# EAGLE design ETS2-Interface (EAGLE 7.7.0)
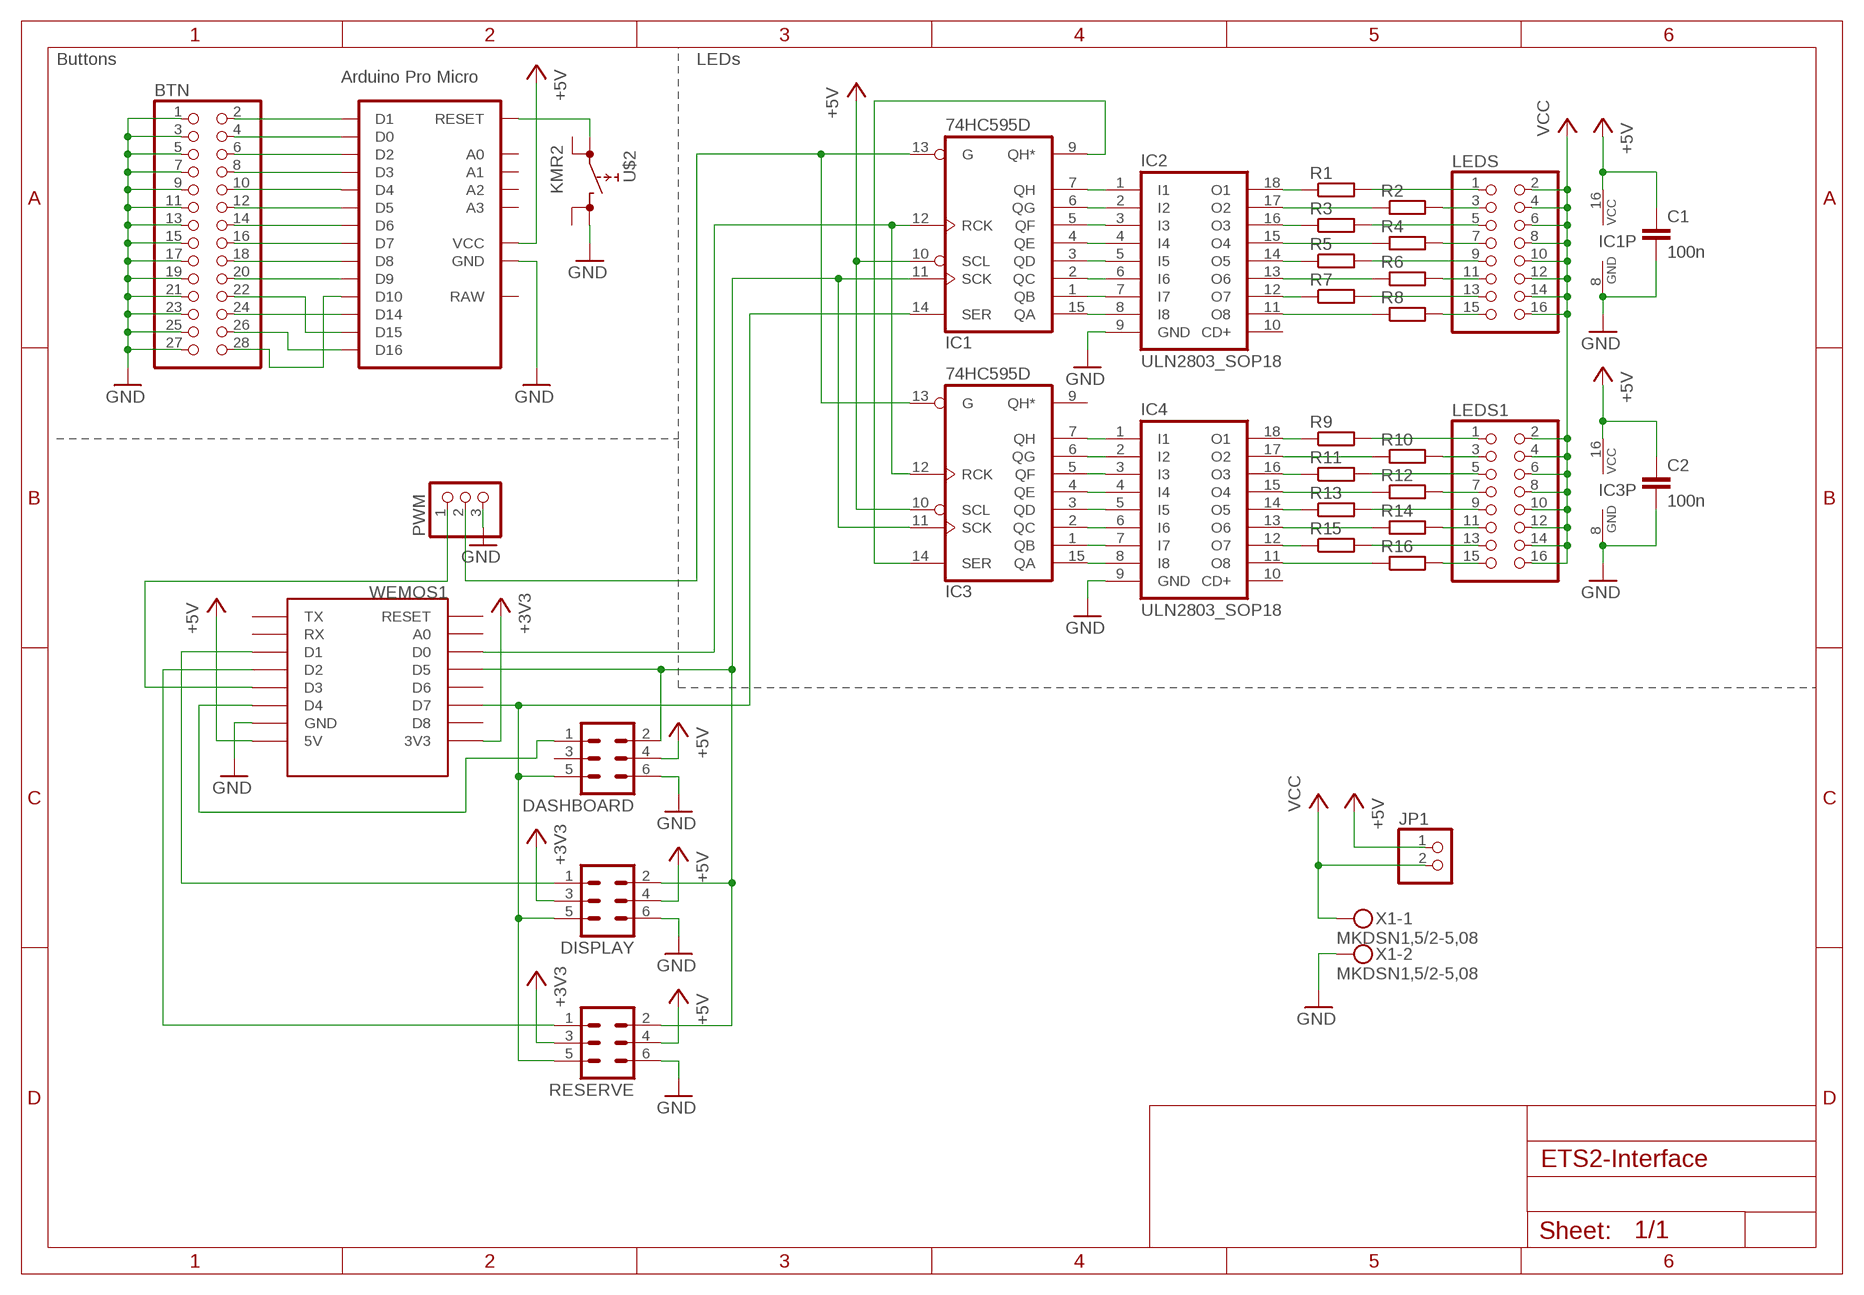
[diagram p0: schematic, sheet 1]

## Parts
BTN  PINHD-2X14_2.54  [2X14]
C1  100n  C-EUC0805  [C0805]
C2  100n  C-EUC0805  [C0805]
DASHBOARD  ML6  [ML6]
DISPLAY  ML6  [ML6]
IC1  74HC595D  [SO16]
IC2  ULN2803_SOP18  [SOP18]
IC3  74HC595D  [SO16]
IC4  ULN2803_SOP18  [SOP18]
JP1  PINHD-1X02_2.54-S  [1X02-S]
LEDS  PINHD-2X08_2.54  [2X08]
LEDS1  PINHD-2X08_2.54  [2X08]
PWM  PINHD-1X03_2.54-S  [1X03-S]
R1  R-EU_R0805  [R0805]
R2  R-EU_R0805  [R0805]
R3  R-EU_R0805  [R0805]
R4  R-EU_R0805  [R0805]
R5  R-EU_R0805  [R0805]
R6  R-EU_R0805  [R0805]
R7  R-EU_R0805  [R0805]
R8  R-EU_R0805  [R0805]
R9  R-EU_R0805  [R0805]
R10  R-EU_R0805  [R0805]
R11  R-EU_R0805  [R0805]
R12  R-EU_R0805  [R0805]
R13  R-EU_R0805  [R0805]
R14  R-EU_R0805  [R0805]
R15  R-EU_R0805  [R0805]
R16  R-EU_R0805  [R0805]
RESERVE  ML6  [ML6]
U$1  PRO-MICRO  [PRO-MICRO]
U$2  KMR2  [KMR2]
WEMOS1  WEMOS-D1-MINI  [WEMOS-D1-MINI]
X1  MKDSN1,5/2-5,08  [MKDSN1,5/2-5,08]

## Nets
+3V3: DISPLAY.3 RESERVE.3 WEMOS1.3V3
+5V: C1.1 C2.1 DASHBOARD.4 DISPLAY.4 IC1.10(SCL) IC1.16(VCC) IC3.10(SCL) IC3.16(VCC) JP1.1 RESERVE.4 U$1.VCC WEMOS1.5V
CLOCK: DASHBOARD.2 DISPLAY.2 IC1.11(SCK) IC3.11(SCK) RESERVE.2 WEMOS1.D5
GND: BTN.1 BTN.3 BTN.5 BTN.7 BTN.9 BTN.11 BTN.13 BTN.15 BTN.17 BTN.19 BTN.21 BTN.23 BTN.25 BTN.27 C1.2 C2.2 DASHBOARD.6 DISPLAY.6 IC1.8(GND) IC2.9(GND) IC3.8(GND) IC4.9(GND) PWM.3 RESERVE.6 U$1.GND U$1.GND1(GND) U$1.GND2(GND) U$2.3 WEMOS1.GND X1.2
LATCH: DASHBOARD.1 WEMOS1.D4
MOSI: DASHBOARD.5 DISPLAY.5 IC1.14(SER) RESERVE.5 WEMOS1.D7
N$1: BTN.2 U$1.D1
N$2: BTN.4 U$1.D0
N$3: BTN.6 U$1.D2
N$4: BTN.8 U$1.D3
N$5: BTN.10 U$1.D4
N$6: BTN.12 U$1.D5
N$7: BTN.14 U$1.D6
N$8: BTN.16 U$1.D7
N$9: BTN.18 U$1.D8
N$10: BTN.20 U$1.D9
N$11: IC1.7(QH) IC2.1(I1)
N$12: IC1.6(QG) IC2.2(I2)
N$13: IC1.5(QF) IC2.3(I3)
N$14: IC1.4(QE) IC2.4(I4)
N$15: IC1.3(QD) IC2.5(I5)
N$16: IC1.2(QC) IC2.6(I6)
N$17: IC1.1(QB) IC2.7(I7)
N$18: IC1.15(QA) IC2.8(I8)
N$19: IC2.18(O1) R1.1
N$20: IC2.17(O2) R2.1
N$21: IC2.16(O3) R3.1
N$22: IC2.15(O4) R4.1
N$23: IC2.14(O5) R5.1
N$24: IC2.13(O6) R6.1
N$25: IC2.12(O7) R7.1
N$26: IC2.11(O8) R8.1
N$27: LEDS.15 R8.2
N$28: LEDS.13 R7.2
N$29: LEDS.11 R6.2
N$30: LEDS.9 R5.2
N$31: LEDS.7 R4.2
N$32: LEDS.5 R3.2
N$33: LEDS.3 R2.2
N$34: LEDS.1 R1.2
N$35: BTN.28 U$1.D10
N$36: BTN.26 U$1.D16
N$37: BTN.24 U$1.D14
N$38: BTN.22 U$1.D15
N$39: IC3.7(QH) IC4.1(I1)
N$40: IC3.6(QG) IC4.2(I2)
N$41: IC3.5(QF) IC4.3(I3)
N$42: IC3.4(QE) IC4.4(I4)
N$43: IC3.3(QD) IC4.5(I5)
N$44: IC3.2(QC) IC4.6(I6)
N$45: IC3.1(QB) IC4.7(I7)
N$46: IC3.15(QA) IC4.8(I8)
N$47: IC4.18(O1) R9.1
N$48: IC4.17(O2) R10.1
N$49: IC4.16(O3) R11.1
N$50: IC4.15(O4) R12.1
N$51: IC4.14(O5) R13.1
N$52: IC4.13(O6) R14.1
N$53: IC4.12(O7) R15.1
N$54: IC4.11(O8) R16.1
N$55: LEDS1.15 R16.2
N$56: LEDS1.13 R15.2
N$57: LEDS1.11 R14.2
N$58: LEDS1.9 R13.2
N$59: LEDS1.7 R12.2
N$60: LEDS1.5 R11.2
N$61: LEDS1.3 R10.2
N$62: LEDS1.1 R9.2
N$63: RESERVE.1 WEMOS1.D2
N$64: IC1.9(QH*) IC3.14(SER)
N$65: IC1.12(RCK) IC3.12(RCK) WEMOS1.D0
N$66: DISPLAY.1 WEMOS1.D1
N$67: PWM.1 WEMOS1.D3
N$68: IC1.13(G) IC3.13(G) PWM.2
N$69: U$1.RESET U$2.1
VCC: JP1.2 LEDS1.2 LEDS1.4 LEDS1.6 LEDS1.8 LEDS1.10 LEDS1.12 LEDS1.14 LEDS1.16 LEDS.2 LEDS.4 LEDS.6 LEDS.8 LEDS.10 LEDS.12 LEDS.14 LEDS.16 X1.1
Unconnected: DASHBOARD.3 IC2.10(CD+) IC3.9(QH*) IC4.10(CD+) U$1.A0 U$1.A1 U$1.A2 U$1.A3 U$1.RAW U$2.2 U$2.4 WEMOS1.A0 WEMOS1.D6 WEMOS1.D8 WEMOS1.RESET WEMOS1.RX WEMOS1.TX

## Notes on the sheet
- Buttons | LEDs
- Arduino Pro Micro

## Library data of the parts
BTN = pinhead-2:PINHD-2X14: PIN HEADER
C1 C2 = rcl:C-EU: CAPACITOR, European symbol
DASHBOARD DISPLAY RESERVE = con-harting-ml:ML6: HARTING; OC_FARNELL: unknown; OC_NEWARK: unknown
IC1 IC3 = 74xx-eu:74*595: 8-bit SHIFT REGISTER, output latch
IC2 IC4 = EA Displays:ULN2803_SOP18
JP1 = pinhead-2:PINHD-1X02: PIN HEADER
LEDS LEDS1 = pinhead-2:PINHD-2X08: PIN HEADER
PWM = pinhead-2:PINHD-1X03: PIN HEADER
R1-R16 = rcl:R-EU_: RESISTOR, European symbol
U$1 = Arduino-clone:PRO-MICRO
U$2 = Cekalla:KMR2
WEMOS1 = esp8266modules:WEMOS-D1-MINI: WeMos.cc D1 mini ESP8266 module
X1 = con-phoenix-508:MKDSN1,5/2-5,08: MKDSN 1,5/ 2-5,08 Printklemme Nennstrom: 13,5 A Nennspannung: 250 V Rastermaß: 5,08 mm Polzahl: 2 Anschlussart: Schraubanschluss Montage: Löten Anschlussrichtung Leiter/Platine: 0 ° Artikelnummer: 1729128 Source: http://eshop.phoenixcontact.com .. 1729128.pdf

## Board
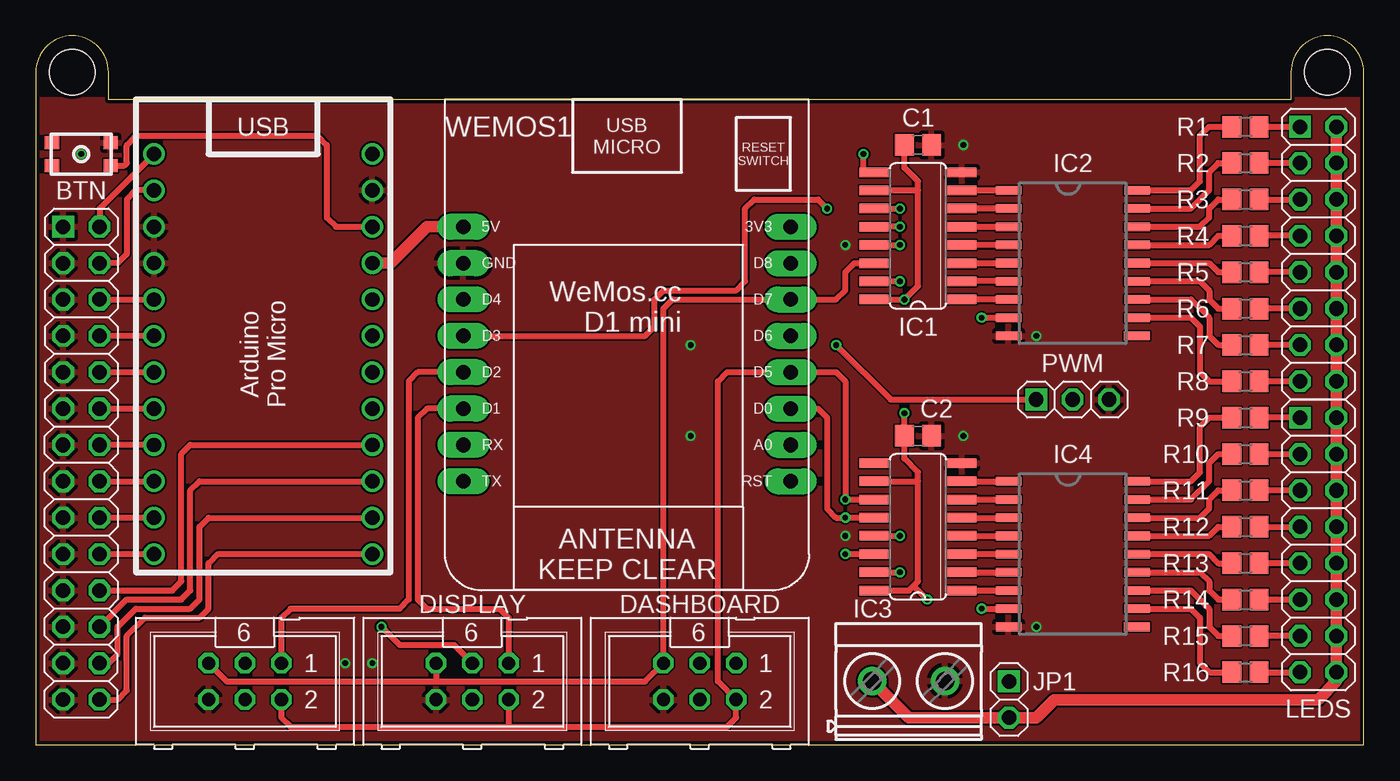
[diagram p1: board, top side]
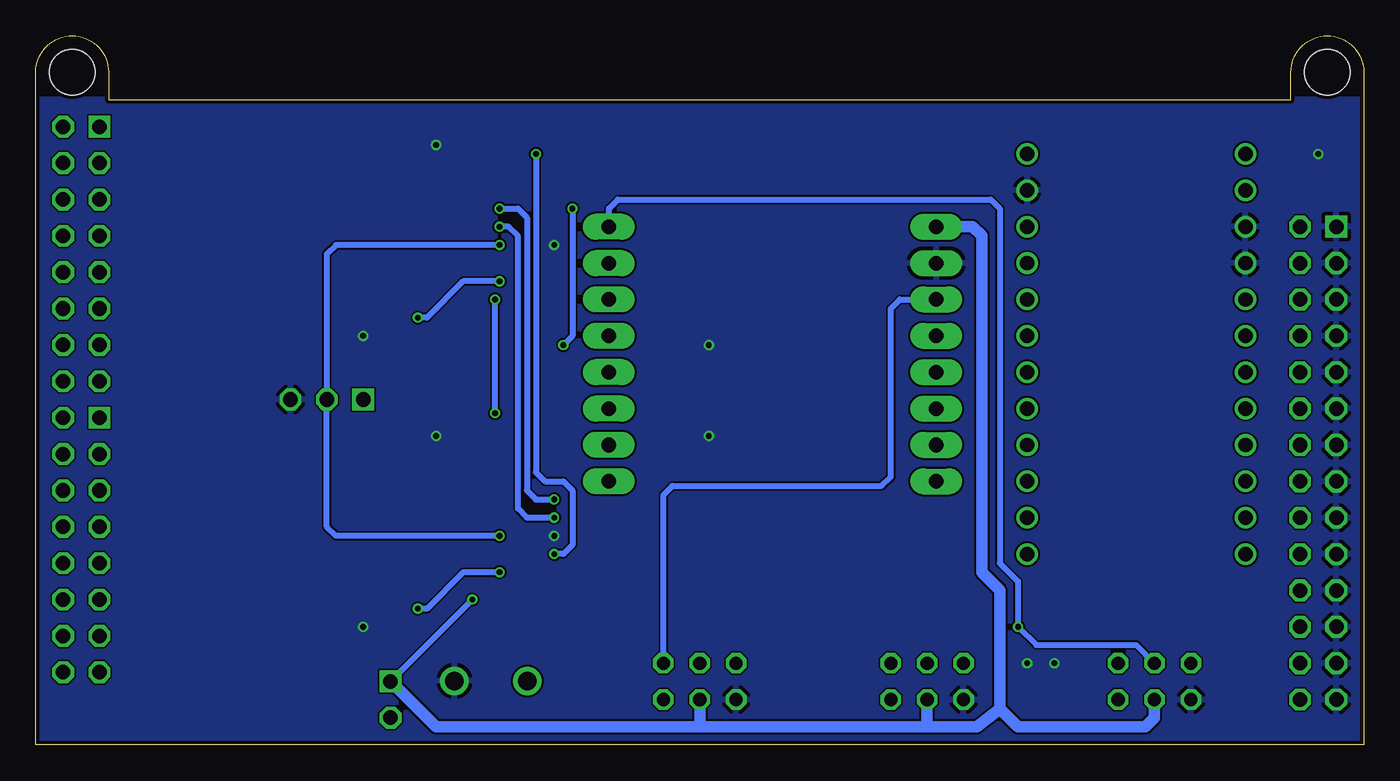
[diagram p2: board, bottom side, seen from below]

Size 92.71 x 49.53 mm. Coordinates in mm from the lower left corner, seen from the top.
Outline: 0,0 92.71,0 92.71,46.99 arc90 90.17,49.53 arc90 87.63,46.99 87.63,45.09 5.08,45.09 5.08,46.99 arc90 2.54,49.53 arc90 0,46.99 0,0
Copper layers (1*16): Top 0.035mm / dielectric 1.5mm / Bottom 0.035mm
Design rules "JLCPCB": minimum track width 5mil, minimum drill 0.3mm, track to track 5mil, track to pad 5mil, pad to pad 5mil, via to via 5mil, smd to smd 0mil, copper to edge 10mil, drill to drill 10mil, minimum pad ring 10mil, minimum via ring 6mil, stop-mask expansion 2mil, vias tented up to drill 100mil, thermal gap 10mil
Holes 3.2 mm at 2.54,46.99 90.17,46.99

### Footprints (pad centres in the part's own frame; a part is rotated, then mirrored left to right if it is on the bottom)
2X14 = drill 1.016 square: 1 -16.51,-1.27 | drill 1.016 octagon: 2 -16.51,1.27; 3 -13.97,-1.27; 4 -13.97,1.27; 5 -11.43,-1.27; 6 -11.43,1.27; 7 -8.89,-1.27; 8 -8.89,1.27; 9 -6.35,-1.27; 10 -6.35,1.27; 11 -3.81,-1.27; 12 -3.81,1.27; 13 -1.27,-1.27; 14 -1.27,1.27; 15 1.27,-1.27; 16 1.27,1.27; 17 3.81,-1.27; 18 3.81,1.27; 19 6.35,-1.27; 20 6.35,1.27; 21 8.89,-1.27; 22 8.89,1.27; 23 11.43,-1.27; 24 11.43,1.27; 25 13.97,-1.27; 26 13.97,1.27; 27 16.51,-1.27; 28 16.51,1.27
C0805 = smd 1.3 x 1.5: 1 -0.95,0; 2 0.95,0
ML6 = drill 0.914 octagon: 1 -2.54,-1.27; 2 -2.54,1.27; 3 0,-1.27; 4 0,1.27; 5 2.54,-1.27; 6 2.54,1.27
SO16 = smd 0.66 x 2.032: 1 -4.445,-3.073; 2 -3.175,-3.073; 3 -1.905,-3.073; 4 -0.635,-3.073; 5 0.635,-3.073; 6 1.905,-3.073; 7 3.175,-3.073; 8 4.445,-3.073; 9 4.445,3.073; 10 3.175,3.073; 11 1.905,3.073; 12 0.635,3.073; 13 -0.635,3.073; 14 -1.905,3.073; 15 -3.175,3.073; 16 -4.445,3.073
SOP18 = smd 0.6 x 1.8: 1 -5.08,-4.475; 2 -3.81,-4.475; 3 -2.54,-4.475; 4 -1.27,-4.475; 5 0,-4.475; 6 1.27,-4.475; 7 2.54,-4.475; 8 3.81,-4.475; 9 5.08,-4.475; 10 5.08,4.475; 11 3.81,4.5; 12 2.54,4.5; 13 1.27,4.5; 14 0,4.5; 15 -1.27,4.5; 16 -2.54,4.5; 17 -3.81,4.5; 18 -5.08,4.5
1X02-S = drill 1.016 square: 1 -1.27,0 | drill 1.016 octagon: 2 1.27,0
2X08 = drill 1.016 square: 1 -8.89,-1.27 | drill 1.016 octagon: 2 -8.89,1.27; 3 -6.35,-1.27; 4 -6.35,1.27; 5 -3.81,-1.27; 6 -3.81,1.27; 7 -1.27,-1.27; 8 -1.27,1.27; 9 1.27,-1.27; 10 1.27,1.27; 11 3.81,-1.27; 12 3.81,1.27; 13 6.35,-1.27; 14 6.35,1.27; 15 8.89,-1.27; 16 8.89,1.27
1X03-S = drill 1.016 square: 1 -2.54,0 | drill 1.016 octagon: 2 0,0; 3 2.54,0
R0805 = smd 1.3 x 1.5: 1 -0.95,0; 2 0.95,0
PRO-MICRO = drill 1: A0 7.62,-3.81; A1 7.62,-1.27; A2 7.62,1.27; A3 7.62,3.81; D0 -7.62,11.43; D1 -7.62,13.97; D2 -7.62,3.81; D3 -7.62,1.27; D4 -7.62,-1.27; D5 -7.62,-3.81; D6 -7.62,-6.35; D7 -7.62,-8.89; D8 -7.62,-11.43; D9 -7.62,-13.97; D10 7.62,-13.97; D14 7.62,-8.89; D15 7.62,-6.35; D16 7.62,-11.43; GND 7.62,11.43; GND1 -7.62,8.89; GND2 -7.62,6.35; RAW 7.62,13.97; RESET 7.62,8.89; VCC 7.62,6.35
KMR2 = smd 1 x 0.9: 1 -2.05,0.8; 2 2.05,0.8; 3 -2.05,-0.8; 4 2.05,-0.8
WEMOS-D1-MINI = drill 1.016 pad 1.829 long: 3V3 -10.16,-10.16; 5V 12.7,-10.16; A0 -10.16,5.08; D0 -10.16,2.54; D1 12.7,2.54; D2 12.7,0; D3 12.7,-2.54; D4 12.7,-5.08; D5 -10.16,0; D6 -10.16,-2.54; D7 -10.16,-5.08; D8 -10.16,-7.62; GND 12.7,-7.62; RESET -10.16,7.62; RX 12.7,5.08; TX 12.7,7.62
MKDSN1,5/2-5,08 = drill 1.3 pad 2: 1 -2.561,0.025; 2 2.519,0.025

### Placement (x,y rotation side)
BTN  3.17,19.68 270 top
C1  61.59,41.91 0 top
C2  61.59,21.59 0 top
DASHBOARD  46.35,4.45 180 top
DISPLAY  30.48,4.45 180 top
IC1  61.59,35.56 90 top
IC2  72.39,33.66 270 top
IC3  61.59,15.24 90 top
IC4  72.39,13.34 270 top
JP1  67.94,3.17 270 top
LEDS  89.53,34.29 270 top
LEDS1  89.53,13.97 270 top
PWM  72.39,24.13 0 top
R1  84.45,43.18 0 top
R2  84.45,40.64 0 top
R3  84.45,38.1 0 top
R4  84.45,35.56 0 top
R5  84.45,33.02 0 top
R6  84.45,30.48 0 top
R7  84.45,27.94 0 top
R8  84.45,25.4 0 top
R9  84.45,22.86 0 top
R10  84.45,20.32 0 top
R11  84.45,17.78 0 top
R12  84.45,15.24 0 top
R13  84.45,12.7 0 top
R14  84.45,10.16 0 top
R15  84.45,7.62 0 top
R16  84.45,5.08 0 top
RESERVE  14.61,4.45 180 top
U$1  15.88,27.3 0 top
U$2  3.17,41.27 180 top
WEMOS1  42.55,26.04 180 top
X1  60.96,4.45 0 top

### Tracks (layer width: path | path; a pad name or v marks a point on that pad's centre or on a via)
+3V3  (via drill 0.4)
  Top 0.406: v24.13,8.26 25.4,6.99 29.21,6.99 DISPLAY.3
  Bottom 0.406: WEMOS1.3V3 52.7,37.47 52.07,38.1 26.04,38.1 25.4,37.47 25.4,12.7 24.13,11.43 v24.13,8.26 22.86,6.99 15.88,6.99 RESERVE.3
+5V  (via drill 0.4)
  Top 0.406: IC1.16 v60.64,31.11 61.59,32.07 61.59,38.73 | 61.59,38.73 61.59,39.37 60.65,40.32 C1.1 | IC3.16 60.96,10.79 61.28,11.11 | 61.28,11.11 61.59,11.43 61.59,18.41 | 61.59,18.41 61.59,19.05 60.65,20 C2.1 v60.64,23.18 | IC1.10 61.59,38.73 | IC3.10 61.59,18.41 | v62.23,10.16 61.28,11.11
  Top 0.813: U$1.VCC 24.77,33.66 27.3,36.2 WEMOS1.5V
  Bottom 0.406: JP1.1 v62.23,10.16 | v60.64,23.18 v60.64,31.11
  Bottom 0.813: WEMOS1.5V 27.3,36.2 26.67,35.56 26.67,12.06 25.4,10.79 25.4,2.54 | 25.4,2.54 26.99,1.27 30.48,1.27 | 30.48,1.27 46.35,1.27 | 46.35,1.27 64.77,1.27 JP1.1 | DASHBOARD.4 46.35,1.27 | DISPLAY.4 30.48,1.27 | 25.4,2.54 24.13,1.27 15.24,1.27 14.61,1.91 RESERVE.4
CLOCK  (via drill 0.4)
  Top 0.406: IC1.11 v60.33,37.47 | IC3.11 v56.52,17.14 56.52,25.4 55.88,26.04 WEMOS1.D5 48.26,26.04 47.62,25.4 47.62,4.45 DASHBOARD.2 48.9,1.91 48.26,1.27 33.02,1.27 | RESERVE.2 17.14,1.91 17.78,1.27 33.02,1.27 | DISPLAY.2 33.02,1.27
  Bottom 0.406: v60.33,37.47 59.05,37.47 58.42,36.83 58.42,17.78 57.78,17.14 v56.52,17.14
GND  (via drill 0.4)
  other vias: 64.77,41.91 64.77,21.59 69.85,28.57 69.85,8.26 45.72,27.94 45.72,21.59 56.52,34.92 56.52,14.61 23.5,5.71 21.59,5.71 3.17,41.27
  pour Bottom: 0,45.09 92.71,45.09 92.71,0 0,0
  pour Top: 0,45.09 92.71,45.09 92.71,0 0,0
LATCH
  Bottom 0.406: DASHBOARD.1 48.9,17.46 48.26,18.1 33.66,18.1 33.02,18.73 33.02,30.48 32.38,31.11 WEMOS1.D4
MOSI
  Top 0.406: IC1.14 57.15,33.66 56.52,33.02 56.52,31.75 55.88,31.11 WEMOS1.D7 44.45,31.11 43.81,30.48 DASHBOARD.5 42.55,4.45 27.94,4.45 | RESERVE.5 13.34,4.45 27.94,4.45 | DISPLAY.5 27.94,4.45
N$1
  Top 0.406: U$1.D1 4.45,37.47 BTN.2
N$2
  Top 0.406: U$1.D0 6.99,38.73 6.35,38.1 6.35,34.29 5.71,33.66 BTN.4
N$3
  Top 0.406: BTN.6 U$1.D2
N$4
  Top 0.406: U$1.D3 BTN.8
N$5
  Top 0.406: BTN.10 U$1.D4
N$6
  Top 0.406: BTN.12 U$1.D5
N$7
  Top 0.406: U$1.D6 BTN.14
N$8
  Top 0.406: BTN.16 U$1.D7
N$9
  Top 0.406: U$1.D8 BTN.18
N$10
  Top 0.406: BTN.20 U$1.D9
N$11
  Top 0.406: IC1.7 IC2.1
N$12
  Top 0.406: IC2.2 IC1.6
N$13
  Top 0.406: IC1.5 IC2.3
N$14
  Top 0.406: IC2.4 IC1.4
N$15
  Top 0.406: IC1.3 IC2.5
N$16
  Top 0.406: IC2.6 IC1.2
N$17
  Top 0.406: IC2.7 IC1.1
N$18  (via drill 0.4)
  Top 0.406: IC1.15 v60.33,32.38 | v66.04,29.84 IC2.8
  Bottom 0.406: v60.33,32.38 62.87,32.38 65.41,29.84 v66.04,29.84
N$19
  Top 0.406: IC2.18 80.64,38.73 81.28,39.37 81.28,42.55 81.92,43.18 R1.1
N$20
  Top 0.406: IC2.17 80.64,37.47 81.92,38.73 81.92,40.01 82.55,40.64 R2.1
N$21
  Top 0.406: IC2.16 81.28,36.2 81.92,36.83 81.92,37.47 82.55,38.1 R3.1
N$22
  Top 0.406: IC2.15 81.92,34.92 82.55,35.56 R4.1
N$23
  Top 0.406: IC2.14 81.92,33.66 82.55,33.02 R5.1
N$24
  Top 0.406: IC2.13 81.28,32.38 81.92,31.75 81.92,31.11 82.55,30.48 R6.1
N$25
  Top 0.406: IC2.12 80.64,31.11 81.92,29.84 81.92,28.57 82.55,27.94 R7.1
N$26
  Top 0.406: IC2.11 80.64,29.84 81.28,29.21 81.28,26.04 81.92,25.4 R8.1
N$27
  Top 0.406: LEDS.15 R8.2
N$28
  Top 0.406: LEDS.13 R7.2
N$29
  Top 0.406: LEDS.11 R6.2
N$30
  Top 0.406: LEDS.9 R5.2
N$31
  Top 0.406: LEDS.7 R4.2
N$32
  Top 0.406: R3.2 LEDS.5
N$33
  Top 0.406: LEDS.3 R2.2
N$34
  Top 0.406: R1.2 LEDS.1
N$35
  Top 0.406: BTN.28 5.71,3.17 6.35,3.81 6.35,7.62 7.62,8.89 11.43,8.89 12.06,9.53 12.06,12.7 12.7,13.34 U$1.D10
N$36
  Top 0.406: BTN.26 5.08,5.71 5.71,6.35 5.71,8.26 6.99,9.53 10.79,9.53 11.43,10.16 11.43,15.24 12.06,15.88 U$1.D16
N$37
  Top 0.406: BTN.24 6.35,10.16 10.16,10.16 10.79,10.79 10.79,17.78 11.43,18.41 U$1.D14
N$38
  Top 0.406: BTN.22 9.53,10.79 10.16,11.43 10.16,20.32 10.79,20.95 U$1.D15
N$39
  Top 0.406: IC3.7 IC4.1
N$40
  Top 0.406: IC3.6 IC4.2
N$41
  Top 0.406: IC3.5 IC4.3
N$42
  Top 0.406: IC3.4 IC4.4
N$43
  Top 0.406: IC3.3 IC4.5
N$44
  Top 0.406: IC3.2 IC4.6
N$45
  Top 0.406: IC3.1 IC4.7
N$46  (via drill 0.4)
  Top 0.406: IC3.15 v60.33,12.06 | v66.04,9.53 IC4.8
  Bottom 0.406: v60.33,12.06 62.87,12.06 65.41,9.53 v66.04,9.53
N$47
  Top 0.406: IC4.18 80.64,18.41 81.28,19.05 81.28,22.23 81.92,22.86 R9.1
N$48
  Top 0.406: IC4.17 80.64,17.14 81.92,18.41 81.92,19.68 82.55,20.32 R10.1
N$49
  Top 0.406: IC4.16 81.28,15.88 81.92,16.51 81.92,17.14 82.55,17.78 R11.1
N$50
  Top 0.406: IC4.15 81.92,14.61 82.55,15.24 R12.1
N$51
  Top 0.406: IC4.14 81.92,13.34 82.55,12.7 R13.1
N$52
  Top 0.406: IC4.13 81.28,12.06 81.92,11.43 81.92,10.79 82.55,10.16 R14.1
N$53
  Top 0.406: IC4.12 80.64,10.79 81.92,9.53 81.92,8.26 82.55,7.62 R15.1
N$54
  Top 0.406: IC4.11 80.64,9.53 81.28,8.89 81.28,5.71 81.92,5.08 R16.1
N$55
  Top 0.406: R16.2 LEDS1.15
N$56
  Top 0.406: LEDS1.13 R15.2
N$57
  Top 0.406: R14.2 LEDS1.11
N$58
  Top 0.406: LEDS1.9 R13.2
N$59
  Top 0.406: R12.2 LEDS1.7
N$60
  Top 0.406: LEDS1.5 R11.2
N$61
  Top 0.406: R10.2 LEDS1.3
N$62
  Top 0.406: LEDS1.1 R9.2
N$63
  Top 0.406: WEMOS1.D2 26.67,26.04 26.04,25.4 26.04,10.16 25.4,9.53 17.78,9.53 17.14,8.89 RESERVE.1
N$64  (via drill 0.4)
  Top 0.406: IC1.9 57.78,40.01 v57.78,41.27 | v56.52,13.34 IC3.14
  Bottom 0.406: v57.78,41.27 57.78,19.05 57.15,18.41 55.88,18.41 55.24,17.78 55.24,13.97 55.88,13.34 v56.52,13.34
N$65  (via drill 0.4)
  Top 0.406: WEMOS1.D0 54.61,23.5 55.24,22.86 55.24,16.51 55.88,15.88 v56.52,15.88 IC3.12 | v60.33,36.2 IC1.12
  Bottom 0.406: v56.52,15.88 58.42,15.88 59.05,16.51 59.05,35.56 59.69,36.2 v60.33,36.2
N$66
  Top 0.406: WEMOS1.D1 27.3,23.5 26.67,22.86 26.67,10.16 27.3,9.53 32.38,9.53 33.02,8.89 DISPLAY.1
N$67  (via drill 0.4)
  Top 0.406: WEMOS1.D3 42.55,28.57 43.18,29.21 43.18,31.11 43.81,31.75 48.9,31.75 49.53,32.38 49.53,37.47 50.16,38.1 54.61,38.1 v55.24,37.47 | v55.88,27.94 59.69,24.13 PWM.1
  Bottom 0.406: v55.24,37.47 55.24,28.57 v55.88,27.94
N$68  (via drill 0.4)
  Top 0.406: IC3.13 v60.33,14.61 | IC1.13 v60.33,34.92
  Bottom 0.406: v60.33,14.61 71.75,14.61 72.39,15.24 PWM.2 72.39,34.29 71.75,34.92 v60.33,34.92
N$69
  Top 0.406: U$1.RESET 20.95,36.2 20.32,36.83 20.32,41.91 19.68,42.55 6.99,42.55 6.35,41.91 6.35,40.64 6.18,40.48 U$2.1
VCC
  Top 0.813: LEDS.2 LEDS.4 LEDS.6 LEDS.8 LEDS.10 LEDS.12 LEDS.14 LEDS.16 LEDS1.2 LEDS1.4 LEDS1.6 LEDS1.8 LEDS1.10 LEDS1.12 LEDS1.14 LEDS1.16 90.81,4.45 89.53,3.17 71.12,3.17 69.85,1.91 JP1.2 60.96,1.91 X1.1